# Altium schematic sheet Sheet3_SenseCkts_Programming_Interface.SchDoc
size B; CompanyName: Microchip Technology Inc.; Organization: Microchip Technology; Address1: 2355 West Chandler Blvd.; Address2: Chandler, AZ  85224; Address4: USA; DocumentNumber: 3; SheetNumber: 3; SheetTotal: 5; SheetTitle: Program/Debug Interface + Sensing/Feedback Ckts; Time: Time
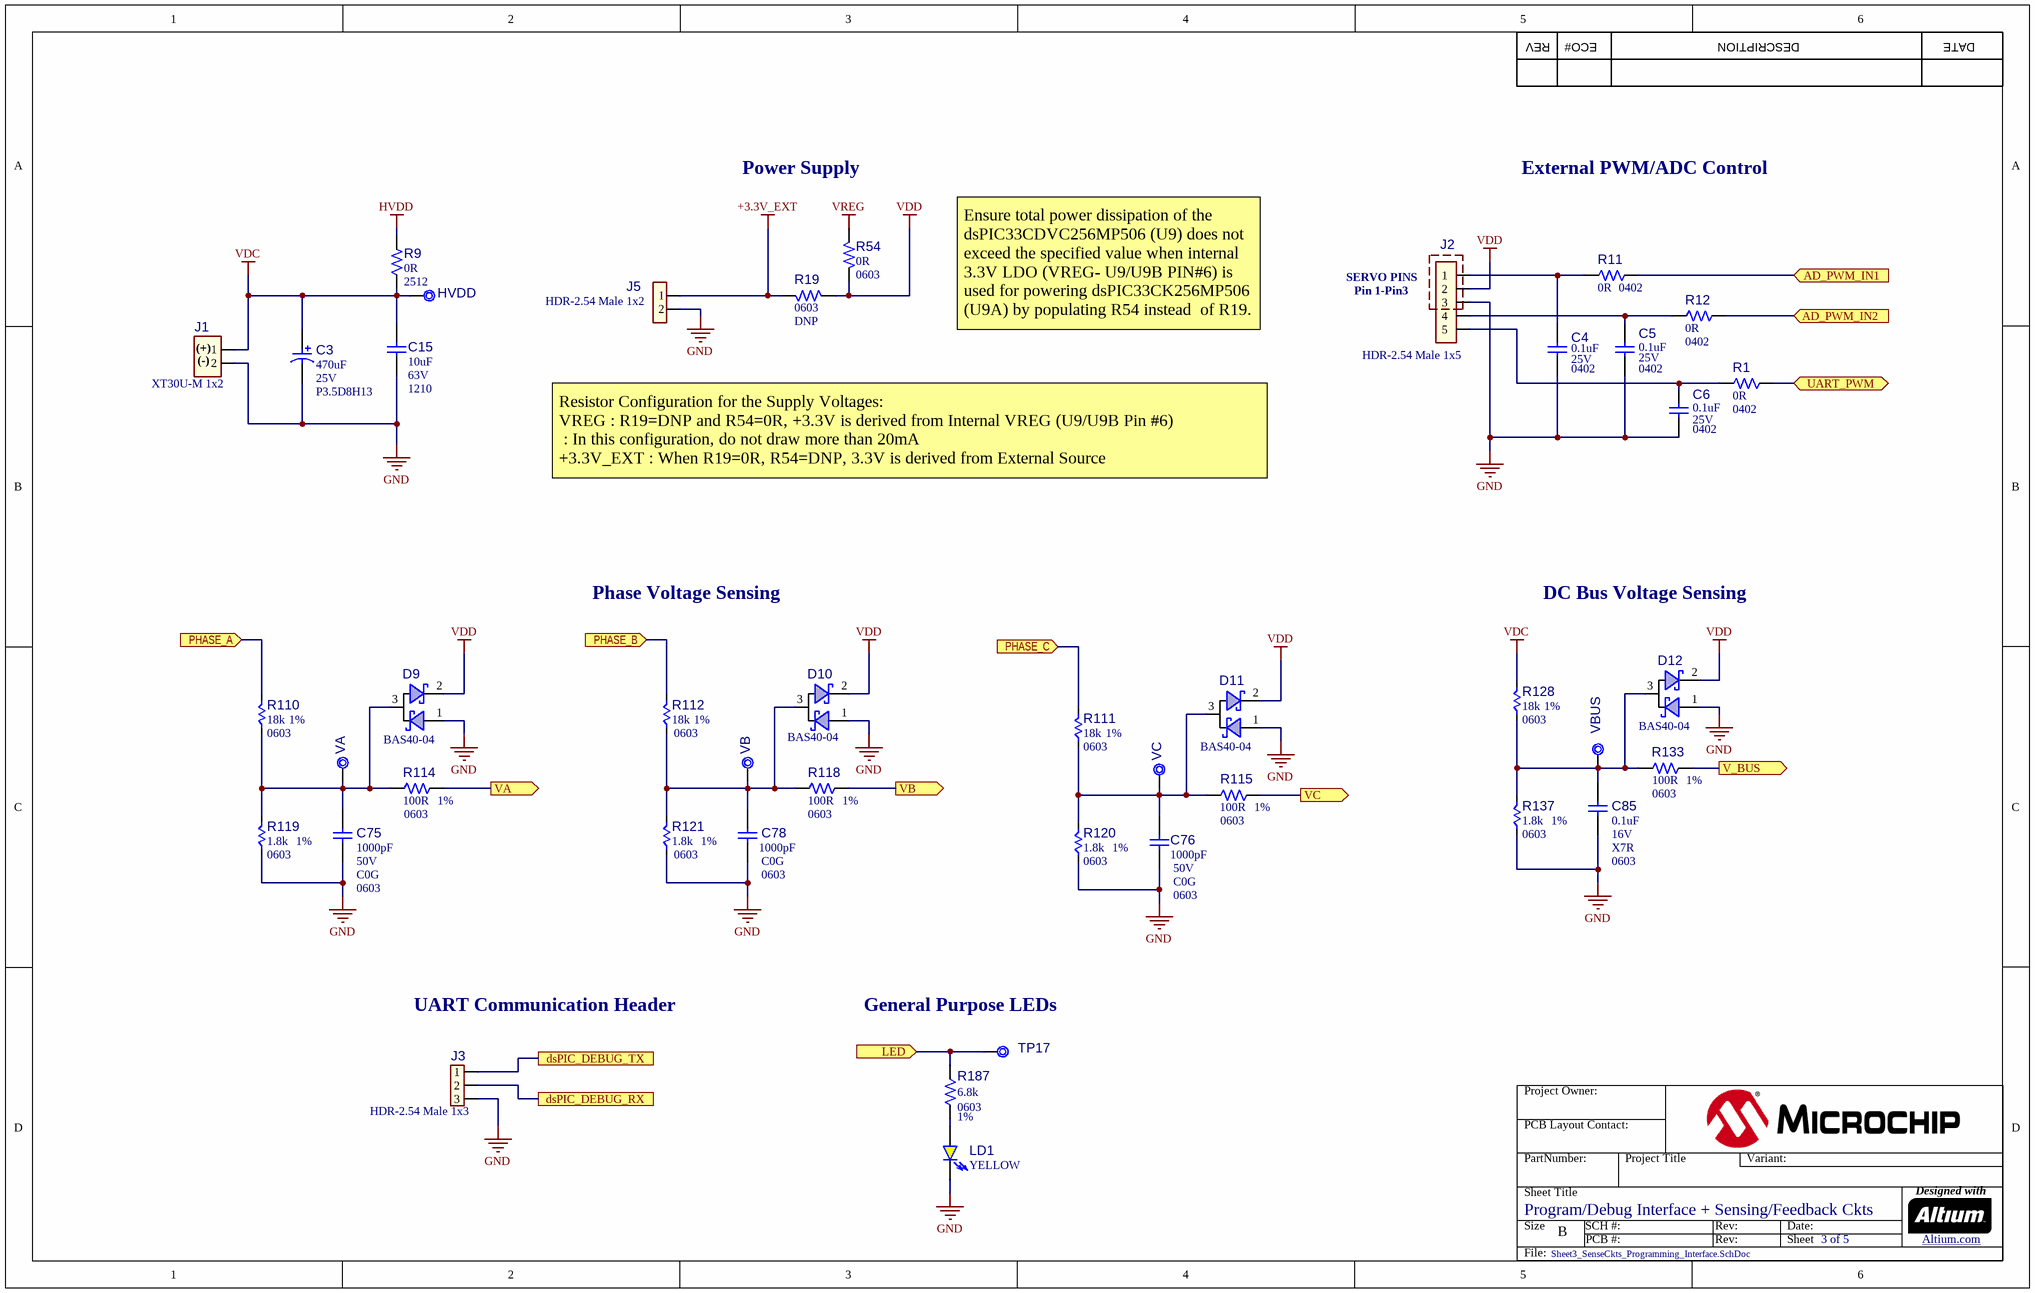
[diagram p0: Sheet3_SenseCkts_Programming_Interface.SchDoc]

## Parts
C3  value 470uF  Voltage: 25V  Package: P3.5D8H13  [CAP_RAD_P3.5D8H13_WE]  (hidden comment: Capacitor POL)
C4  value 0.1uF  Voltage: 25V  Package: 0402  [CAP_C_0402]  (hidden comment: Capacitor NP)
C5  value 0.1uF  Voltage: 25V  Package: 0402  [CAP_C_0402]  (hidden comment: Capacitor NP)
C6  value 0.1uF  Voltage: 25V  Package: 0402  [CAP_C_0402]  (hidden comment: Capacitor NP)
C15  value 10uF  Voltage: 63V  Package: 1210  [CAP_C_1210]  (hidden comment: Capacitor NP)
C75  value 1000pF  Voltage: 50V  Package: 0603  Temperature Coeffcient: C0G  [CAP_C_0603]  (hidden comment: Capacitor NP)
C76  value 1000pF  Voltage: 50V  Package: 0603  Temperature Coeffcient: C0G  [CAP_C_0603]  (hidden comment: Capacitor NP)
C78  value 1000pF  Package: 0603  Temperature Coeffcient: C0G  [CAP_C_0603]  (hidden comment: Capacitor NP)
C85  value 0.1uF  Voltage: 16V  Package: 0603  Temperature Coeffcient: X7R  [CAP_C_0603]  (hidden comment: Capacitor NP)
D9  value BAS40-04  [SOT-23-3]  (hidden comment: Diode Schottky Dual AK)
D10  value BAS40-04  [SOT-23-3]  (hidden comment: Diode Schottky Dual AK)
D11  value BAS40-04  [SOT-23-3]  (hidden comment: Diode Schottky Dual AK)
D12  value BAS40-04  [SOT-23-3]  (hidden comment: Diode Schottky Dual AK)
HVDD  Test Point No BOM  [TP_1.1x0.6]  (value not drawn)  (no BOM)
J1  value XT30U-M 1x2  [CON TERMINAL XT30U-M 5mm 1x2 Male 30A TH V]  (hidden comment: CON 1x2 POLARIZED)
J2  value HDR-2.54 Male 1x5  [HDR_M_2.54_1x5_MH5.84_IH2.54_TH3.2_TH_VERT]  (hidden comment: Header 1x5)
J3  value HDR-2.54 Male 1x3  [HDR_M_2.54_1x3_TH_V_SAM_TSW-103-08-G-S]  (hidden comment: Header 1x3)
J5  value HDR-2.54 Male 1x2  [HDR_M_2.54_1x2_TH_V_SAM_TSW-102-08-G-S]  (hidden comment: Header 1x2)
LD1  value YELLOW  [LED_0603_Yellow]  (hidden comment: LED_yellow)
R1  value 0R  Package: 0402  [RES_C_0402]  (hidden comment: Resistor)
R9  value 0R  Package: 2512  [RES_C_2512]  (hidden comment: Resistor)
R11  value 0R  Package: 0402  [RES_C_0402]  (hidden comment: Resistor)
R12  value 0R  Package: 0402  [RES_C_0402]  (hidden comment: Resistor)
R19  Package: 0603  Populated: DNP  [RES_C_0603]  (hidden comment: Resistor)
R54  value 0R  Package: 0603  [RES_C_0603]
R110  value 18k  Package: 0603  Tolerance: 1%  [RES_C_0603]  (hidden comment: Resistor)
R111  value 18k  Package: 0603  Tolerance: 1%  [RES_C_0603]  (hidden comment: Resistor)
R112  value 18k  Package: 0603  Tolerance: 1%  [RES_C_0603]  (hidden comment: Resistor)
R114  value 100R  Package: 0603  Tolerance: 1%  [RES_C_0603]  (hidden comment: Resistor)
R115  value 100R  Package: 0603  Tolerance: 1%  [RES_C_0603]  (hidden comment: Resistor)
R118  value 100R  Package: 0603  Tolerance: 1%  [RES_C_0603]  (hidden comment: Resistor)
R119  value 1.8k  Package: 0603  Tolerance: 1%  [RES_C_0603]  (hidden comment: Resistor)
R120  value 1.8k  Package: 0603  Tolerance: 1%  [RES_C_0603]  (hidden comment: Resistor)
R121  value 1.8k  Package: 0603  Tolerance: 1%  [RES_C_0603]  (hidden comment: Resistor)
R128  value 18k  Package: 0603  Tolerance: 1%  [RES_C_0603]  (hidden comment: Resistor)
R133  value 100R  Package: 0603  Tolerance: 1%  [RES_C_0603]  (hidden comment: Resistor)
R137  value 1.8k  Package: 0603  Tolerance: 1%  [RES_C_0603]  (hidden comment: Resistor)
R187  value 6.8k  Tolerance: 1%  Package: 0603  [RES_C_0603]  (hidden comment: Resistor)
TP17  Test Point No BOM  [TP_TH_0.7PADX0.4HOLE]  (value not drawn)  (no BOM)
VA  Test Point No BOM  [TP_TH_0.7PADX0.4HOLE]  (value not drawn)  (no BOM)
VB  Test Point No BOM  [TP_TH_0.7PADX0.4HOLE]  (value not drawn)  (no BOM)
VBUS  Test Point No BOM  [TP_TH_0.7PADX0.4HOLE]  (value not drawn)  (no BOM)
VC  Test Point No BOM  [TP_TH_0.7PADX0.4HOLE]  (value not drawn)  (no BOM)

## Ports
AD_PWM_IN1 (in), AD_PWM_IN2 (in), dsPIC_DEBUG_RX, dsPIC_DEBUG_TX, LED (in), PHASE_A (in), PHASE_B (in), PHASE_C (in), UART_PWM (bidir), V_BUS (out), VA (out), VB (out), VC (out)

## Nets
+3.3V_EXT: J5.1 R19.2
GND: C3.2 C4.1 C5.1 C6.1 C15.1 C75.1 C76.1 C78.1 C85.1 D9.1(A) D10.1(A) D11.1(A) D12.1(A) J1.2 J2.3 J3.3 J5.2 LD1.2(K) R119.2 R120.2 R121.2 R137.2
HVDD: R9.2
VDC: C3.1 C15.2 HVDD.1 J1.1 R9.1 R128.1
VDD: D9.2(K) D10.2(K) D11.2(K) D12.2(K) J2.2 R19.1 R54.2
VREG: R54.1
AD_PWM_IN1: R11.2 ; port AD_PWM_IN1
AD_PWM_IN2: R12.2 ; port AD_PWM_IN2
dsPIC_DEBUG_RX: J3.2 ; port dsPIC_DEBUG_RX
dsPIC_DEBUG_TX: J3.1 ; port dsPIC_DEBUG_TX
LED: R187.1 TP17.1 ; port LED
PHASE_A: R110.1 ; port PHASE_A
PHASE_B: R112.1 ; port PHASE_B
PHASE_C: R111.1 ; port PHASE_C
UART_PWM: R1.2 ; port UART_PWM
V_BUS: R133.2 ; port V_BUS
VA: R114.2 ; port VA
VB: R118.2 ; port VB
VC: R115.2 ; port VC
NetC4_2: C4.2 J2.1 R11.1
NetC5_2: C5.2 J2.4 R12.1
NetC6_2: C6.2 J2.5 R1.1
NetC75_2: C75.2 D9.3(KA) R110.2 R114.1 R119.1 VA.1
NetC76_2: C76.2 D11.3(KA) R111.2 R115.1 R120.1 VC.1
NetC78_2: C78.2 D10.3(KA) R112.2 R118.1 R121.1 VB.1
NetC85_2: C85.2 D12.3(KA) R128.2 R133.1 R137.1 VBUS.1
NetLD1_1: LD1.1(A) R187.2

## Notes on the sheet
- REV
- ECO#
- DESCRIPTION
- DATE
- Power Supply
- External PWM/ADC Control
- (near J2) SERVO PINS
- (near J2) Pin 1-Pin3
- Ensure total power dissipation of the dsPIC33CDVC256MP506 (U9) does not exceed the specified value when internal 3.3V LDO (VREG- U9/U9B PIN#6) is used for powering dsPIC33CK256MP506 (U9A) by populating R54 instead  of R19.
- Resistor Configuration for the Supply Voltages:
  VREG	: R19=DNP and R54=0R, +3.3V is derived from Internal VREG (U9/U9B Pin #6)
  : In this configuration, do not draw more than 20mA
  +3.3V_EXT : When R19=0R, R54=DNP, 3.3V is derived from External Source
- Phase Voltage Sensing
- DC Bus Voltage Sensing
- UART Communication Header
- (near TP17) General Purpose LEDs
- Project Owner:
- PCB Layout Contact:
- PartNumber:
- Project Title
- Variant:
- Sheet Title
- Size
- B
- SCH #:
- PCB #:
- Rev:
- Date:
- Sheet
- Designed with
- Altium.com <http://go.altium.com/MicrochipLandingPage_Evaluation.html>
- File:
- (in symbol CON2207) (+); (-)

## Library data of the parts
C3 = CAP3116: Capacitor; Manufacturer 1: Würth Elektronik; Manufacturer Part Number 1: 860020474014; Description_: CAP ALU 470uF 25V 20% RAD P3.5D8H13; Dev Tools Status: Design; Tolerance: 20%; Type: Aluminum; Owner: Severino Balong Jr.; Populated: YES; Restricted Sourcing: No; MCHP-ID: CAP3116; Revision: 1; Symbol: Capacitor POL; Status: MCL Design; ComponentLink1URL: https://chn-vm-apps.microchip.com/mchprepo/parts/Datasheets/860020474014.pdf; ComponentLink1Description: SVN Datasheet; ComponentLink2URL: C:\ALTIUM_WORK\00001_MCHP-CDB\Datasheets\860020474014.pdf; ComponentLink2Description: Local Datasheet; ComponentLink3URL: C:\ALTIUM_WORK\00001_MCHP-CDB\Library\LibraryRefs\Capacitor POL.SchLib; ComponentLink3Description: Open Symbol; ComponentLink4URL: C:\ALTIUM_WORK\00001_MCHP-CDB\Library\Footprints\CAP_RAD_P3.5D8H13_WE.PcbLib; ComponentLink4Description: Open Footprint; ComponentLink5Description: Open Footprint 2; ComponentLink6Description: Open Footprint 3; ComponentLink7Description: Open Footprint 4; Operating Temperature: -40C to +105C; Category: Capacitor; Supplier 1: Digi-Key; Supplier Part Number 1: 732-8831-1-ND; Quantity Override: 1
C4-C6 = CAP1345: Manufacturer 1: TDK Corporation; Manufacturer Part Number 1: C1005X7R1E104K050BB; Description_: CAP CER 0.1uF 25V 10% X7R SMD 0402; Dev Tools Status: Production; Tolerance: 10%; Temperature Coefficient: X7R; Type: Ceramic; Owner: Randolph Sobrepena; Populated: YES; Restricted Sourcing: No; MCHP-ID: CAP1345; Revision: 2; Symbol: Capacitor NP; Status: MCL Design; ComponentLink1URL: https://chn-vm-apps.microchip.com/mchprepo/parts/Datasheets/mlcc_commercial_general_en; ComponentLink1Description: SVN Datasheet; ComponentLink2URL: C:\ALTIUM_WORK\00001_MCHP-CDB\Datasheets\mlcc_commercial_general_en; ComponentLink2Description: Local Datasheet; ComponentLink3URL: C:\ALTIUM_WORK\00001_MCHP-CDB\Library\LibraryRefs\Capacitor NP.SchLib; ComponentLink3Description: Open Symbol; ComponentLink4URL: C:\ALTIUM_WORK\00001_MCHP-CDB\Library\Footprints\CAP_C_0402.PcbLib; ComponentLink4Description: Open Footprint; ComponentLink5Description: Open Footprint 2; ComponentLink6Description: Open Footprint 3; ComponentLink7Description: Open Footprint 4; Operating Temperature: -55°C to 125°C; Category: Capacitor; Supplier 1: Digi-Key; Supplier Part Number 1: 445-7348-1-ND; Quantity Override: 1
C15 = CAP2578: Manufacturer 1: Samsung Electro-Mechanics; Manufacturer Part Number 1: CL32B106KMVNNWE; Description_: CAP CER 10uF 63V 10% X7R SMD 1210; Dev Tools Status: Design; Tolerance: 10%; Temperature Coefficient: X7R; Type: Ceramic; Owner: Narasimha Murthy; Populated: YES; MCHP-ID: CAP2578; Revision: 1; Symbol: Capacitor NP; Status: MCL Design; ComponentLink1URL: https://chn-vm-apps.microchip.com/mchprepo/parts/Datasheets/CL32B106KMVNNWE_Spec.pdf; ComponentLink1Description: SVN Datasheet; ComponentLink2URL: C:\ALTIUM_WORK\00001_MCHP-CDB\Datasheets\CL32B106KMVNNWE_Spec.pdf; ComponentLink2Description: Local Datasheet; ComponentLink3URL: C:\ALTIUM_WORK\00001_MCHP-CDB\Library\LibraryRefs\Capacitor NP.SchLib; ComponentLink3Description: Open Symbol; ComponentLink4URL: C:\ALTIUM_WORK\00001_MCHP-CDB\Library\Footprints\CAP_C_1210.PcbLib; ComponentLink4Description: Open Footprint; ComponentLink5Description: Open Footprint 2; ComponentLink6Description: Open Footprint 3; ComponentLink7Description: Open Footprint 4; Operating Temperature: -55C to +125C; Category: Capacitor; Supplier 1: Digi-Key; Supplier Part Number 1: 1276-7053-1-ND; Quantity Override: 1
C75 C76 = CAP0594: Capacitor; Manufacturer 1: AVX; Manufacturer Part Number 1: 06035A102JAT2A; Description_: CAP CER 1000pF 50V 5% C0G SMD 0603; Dev Tools Status: Production; Tolerance: 5%; Type: Ceramic; Populated: Yes; MCHP-ID: CAP0594; Revision: 1; Symbol: Capacitor NP; Status: MCL Design; ComponentLink1URL: https://chn-vm-apps.microchip.com/mchprepo/parts/Datasheets/smccp.pdf; ComponentLink1Description: SVN Datasheet; ComponentLink2URL: C:\ALTIUM_WORK\00001_MCHP-CDB\Datasheets\smccp.pdf; ComponentLink2Description: Local Datasheet; ComponentLink3URL: C:\ALTIUM_WORK\00001_MCHP-CDB\Library\LibraryRefs\Capacitor NP.SchLib; ComponentLink3Description: Open Symbol; ComponentLink4URL: C:\ALTIUM_WORK\00001_MCHP-CDB\Library\Footprints\CAP_C_0603.PcbLib; ComponentLink4Description: Open Footprint; ComponentLink5Description: Open Footprint 2; ComponentLink6Description: Open Footprint 3; ComponentLink7Description: Open Footprint 4; Operating Temperature: -55C to +125C; Category: Capacitor; Manufacturer 2: TDK; Manufacturer Part Number 2: C1608C0G1H102J; Manufacturer 3: Murata Electronics North America; Manufacturer Part Number 3: GCM1885C1H102JA16D; Supplier 1: Digi-Key; Supplier Part Number 1: 478-1187-2-ND; Supplier 2: Digi-Key; Supplier Part Number 2: 445-1293-2-ND; Supplier 3: Digi-Key; Supplier Part Number 3: 490-4768-1-ND; Quantity Override: 1
C78 = CAP0594: Capacitor; Manufacturer 1: AVX; Manufacturer Part Number 1: 06035A102JAT2A; Voltage: 50V; Description_: CAP CER 1000pF 50V 5% C0G SMD 0603; Dev Tools Status: Production; Tolerance: 5%; Type: Ceramic; Populated: Yes; MCHP-ID: CAP0594; Revision: 1; Symbol: Capacitor NP; Status: MCL Design; ComponentLink1URL: https://chn-vm-apps.microchip.com/mchprepo/parts/Datasheets/smccp.pdf; ComponentLink1Description: SVN Datasheet; ComponentLink2URL: C:\ALTIUM_WORK\00001_MCHP-CDB\Datasheets\smccp.pdf; ComponentLink2Description: Local Datasheet; ComponentLink3URL: C:\ALTIUM_WORK\00001_MCHP-CDB\Library\LibraryRefs\Capacitor NP.SchLib; ComponentLink3Description: Open Symbol; ComponentLink4URL: C:\ALTIUM_WORK\00001_MCHP-CDB\Library\Footprints\CAP_C_0603.PcbLib; ComponentLink4Description: Open Footprint; ComponentLink5Description: Open Footprint 2; ComponentLink6Description: Open Footprint 3; ComponentLink7Description: Open Footprint 4; Operating Temperature: -55C to +125C; Category: Capacitor; Manufacturer 2: TDK; Manufacturer Part Number 2: C1608C0G1H102J; Manufacturer 3: Murata Electronics North America; Manufacturer Part Number 3: GCM1885C1H102JA16D; Supplier 1: Digi-Key; Supplier Part Number 1: 478-1187-2-ND; Supplier 2: Digi-Key; Supplier Part Number 2: 445-1293-2-ND; Supplier 3: Digi-Key; Supplier Part Number 3: 490-4768-1-ND; Quantity Override: 1
C85 = CAP0011: Capacitor; Manufacturer 1: Taiyo Yuden; Manufacturer Part Number 1: EMK107B7104KA-T; Description_: CAP CER 0.1uF 16V 10% X7R SMD 0603; Dev Tools Status: Production; Tolerance: 10%; Type: Ceramic; Owner: Cristian Papuc; Populated: YES; MCHP-ID: CAP0011; Revision: 3; Symbol: Capacitor NP; Status: MCL Design; ComponentLink1URL: https://chn-vm-apps.microchip.com/mchprepo/parts/Datasheets/nmc2.pdf; ComponentLink1Description: SVN Datasheet; ComponentLink2URL: C:\ALTIUM_WORK\00001_MCHP-CDB\Datasheets\nmc2.pdf; ComponentLink2Description: Local Datasheet; ComponentLink3URL: C:\ALTIUM_WORK\00001_MCHP-CDB\Library\LibraryRefs\Capacitor NP.SchLib; ComponentLink3Description: Open Symbol; ComponentLink4URL: C:\ALTIUM_WORK\00001_MCHP-CDB\Library\Footprints\CAP_C_0603.PcbLib; ComponentLink4Description: Open Footprint; ComponentLink5Description: Open Footprint 2; ComponentLink6Description: Open Footprint 3; ComponentLink7Description: Open Footprint 4; Operating Temperature: -55C to +125C; Category: Capacitor; Manufacturer 2: Wurth Electronics Inc; Manufacturer Part Number 2: 885012206046; Manufacturer 3: Samsung; Manufacturer Part Number 3: CL10B104KO8NNNC; Manufacturer 4: AVX; Manufacturer Part Number 4: 0603YC104KAT2A; Manufacturer 5: Murata; Manufacturer Part Number 5: GRM188R71C104KA01D; Manufacturer 6: Yageo; Manufacturer Part Number 6: CC0603KRX7R7BB104; Manufacturer 7: Taiyo Yuden; Manufacturer Part Number 7: EMK107B7104KA-T; Manufacturer 8: Murata Electronics North America; Manufacturer Part Number 8: GCM188R71C104KA37D; Supplier 1: Digi-Key; Supplier Part Number 1: 587-1240-1-ND; Supplier 2: Digi-Key; Supplier Part Number 2: 732-7965-1-ND; Supplier 3: Digi-Key; Supplier Part Number 3: 1276-1005-1-ND; Supplier 4: Digi-Key; Supplier Part Number 4: 478-1239-1-ND; Supplier 5: Digi-Key; Supplier Part Number 5: 490-1532-1-ND; Supplier 6: Digi-Key; Supplier Part Number 6: 311-1088-1-ND; Supplier 7: Newark; Supplier Part Number 7: 86H5248; Supplier 8: Digi-Key; Supplier Part Number 8: 490-4774-1-ND; Quantity Override: 1
D9-D12 = DIODE1074: Manufacturer 1: Vishay Semiconductor Diodes Division; Manufacturer Part Number 1: BAS40-04-E3-08; Description_: DIO SCTKYARR BAS40-04 1V 200mA 40V SOT-23-3; Dev Tools Status: Production; Type: Schottky Array; Forward Current: 200mA; Power: 200mW; Reverse Current: 100nA; Reverse Voltage: 40V; Owner: Stephen Humberd; Populated: YES; MCHP-ID: DIODE1074; Revision: A; Symbol: Diode Schottky DUAL AK; Status: MCL Design; Package: SOT-23-3; ComponentLink1URL: https://chn-vm-apps.microchip.com/mchprepo/parts/Datasheets/bas40v.pdf; ComponentLink1Description: SVN Datasheet; ComponentLink2URL: C:\ALTIUM_WORK\00001_MCHP-CDB\Datasheets\bas40v.pdf; ComponentLink2Description: Local Datasheet; ComponentLink3URL: C:\ALTIUM_WORK\00001_MCHP-CDB\Library\LibraryRefs\Diode Schottky DUAL AK.SchLib; ComponentLink3Description: Open Symbol; ComponentLink4URL: C:\ALTIUM_WORK\00001_MCHP-CDB\Library\Footprints\SOT-23-3.PcbLib; ComponentLink4Description: Open Footprint; ComponentLink5Description: Open Footprint 2; ComponentLink6Description: Open Footprint 3; ComponentLink7Description: Open Footprint 4; Operating Temperature: -65C to +125C; Category: Diode; Supplier 1: Digi-Key; Supplier Part Number 1: BAS40-04-E3-08CT-ND; Quantity Override: 1
HVDD = CON2734: Test Point; Description_: CON TP PAD PCB TH D1.1H0.6; Dev Tools Status: Design; Owner: Severino Balong Jr.; Populated: DNP; Value: TP TH D1.1H0.6; MCHP-ID: CON2734; Revision: 1; Symbol: Test Point No BOM; Status: MCL Design; ComponentLink1Description: SVN Datasheet; ComponentLink2Description: Local Datasheet; ComponentLink3URL: C:\ALTIUM_WORK\00001_MCHP-CDB\Library\LibraryRefs\Test Point No BOM.SchLib; ComponentLink3Description: Open Symbol; ComponentLink4URL: C:\ALTIUM_WORK\00001_MCHP-CDB\Library\Footprints\TP_1.1x0.6.PcbLib; ComponentLink4Description: Open Footprint; ComponentLink5Description: Open Footprint 2; ComponentLink6Description: Open Footprint 3; ComponentLink7Description: Open Footprint 4; Type: Test Point No BOM; Category: Connector; Quantity Override: 1; Restricted Sourcing: No
J1 = CON2207: Manufacturer 1: AMASS; Manufacturer Part Number 1: XT30U-M; Description_: CON POWER XT30U-M 5mm 1x2 Male 15A TH V; Dev Tools Status: Design; Owner: Octavian Stroe; Voltage: 500V; Current: 15A; Populated: Yes; MCHP-ID: CON2207; Revision: 1; Symbol: CON 1x2 POLARIZED; Status: MCL Design; ComponentLink1URL: https://chn-vm-apps.microchip.com/mchprepo/parts/Datasheets/XT30U SPEC.pdf; ComponentLink1Description: SVN Datasheet; ComponentLink2URL: C:\ALTIUM_WORK\00001_MCHP-CDB\Datasheets\XT30U SPEC.pdf; ComponentLink2Description: Local Datasheet; ComponentLink3URL: C:\ALTIUM_WORK\00001_MCHP-CDB\Library\LibraryRefs\CON 1x2 POLARIZED.SchLib; ComponentLink3Description: Open Symbol; ComponentLink4URL: C:\ALTIUM_WORK\00001_MCHP-CDB\Library\Footprints\CON TERMINAL XT30U-M 5mm 1x2 Male 30A TH V.PcbLib; ComponentLink4Description: Open Footprint; ComponentLink5Description: Open Footprint 2; ComponentLink6Description: Open Footprint 3; ComponentLink7Description: Open Footprint 4; Type: Power; Category: Connector; Supplier 1: TME; Supplier Part Number 1: XT30U-M; Quantity Override: 1
J2 = CON3098: Manufacturer 1: Samtec; Manufacturer Part Number 1: TSW-105-26-S-S; Description_: CON HDR-2.54 Male 1x5 Gold 5.84MH 2.54IH 3.2TH TH VERT; Dev Tools Status: Design; Owner: Deepak Kariyappa; Populated: YES; Restricted Sourcing: No; MCHP-ID: CON3098; Revision: 1; Symbol: Header 1x5; Status: MCL Design; ComponentLink1URL: https://chn-vm-apps.microchip.com/mchprepo/parts/Datasheets/tsw_th.pdf; ComponentLink1Description: SVN Datasheet; ComponentLink2URL: C:\ALTIUM_WORK\00001_MCHP-CDB\Datasheets\tsw_th.pdf; ComponentLink2Description: Local Datasheet; ComponentLink3URL: C:\ALTIUM_WORK\00001_MCHP-CDB\Library\LibraryRefs\Header 1x5.SchLib; ComponentLink3Description: Open Symbol; ComponentLink4URL: C:\ALTIUM_WORK\00001_MCHP-CDB\Library\Footprints\HDR_M_2.54_1x5_MH5.84_IH2.54_TH3.2_TH_VERT.PcbLib; ComponentLink4Description: Open Footprint; ComponentLink5Description: Open Footprint 2; ComponentLink6Description: Open Footprint 3; ComponentLink7Description: Open Footprint 4; Type: Header 2.54mm; Category: Connector; Supplier 1: Digi-Key; Supplier Part Number 1: 612-TSW-105-26-S-S-ND; Quantity Override: 1; Assembly Type: TH; Operating Temperature: –55C to +125C
J3 = CON2895: Manufacturer 1: Samtec; Manufacturer Part Number 1: TSW-103-08-G-S; Description_: CON HDR-2.54 Male 1x3 Gold 5.84MH  TH VERT; Dev Tools Status: Production; Owner: Dragos Danaila; Populated: YES; Restricted Sourcing: No; Voltage: 550VAC; Current: 6.3A; MCHP-ID: CON2895; Revision: 3; Symbol: Header 1x3; Status: MCL Design; ComponentLink1URL: https://chn-vm-apps.microchip.com/mchprepo/parts/Datasheets/tsw_th.pdf; ComponentLink1Description: SVN Datasheet; ComponentLink2URL: C:\ALTIUM_WORK\00001_MCHP-CDB\Datasheets\tsw_th.pdf; ComponentLink2Description: Local Datasheet; ComponentLink3URL: C:\ALTIUM_WORK\00001_MCHP-CDB\Library\LibraryRefs\Header 1x3.SchLib; ComponentLink3Description: Open Symbol; ComponentLink4URL: C:\ALTIUM_WORK\00001_MCHP-CDB\Library\Footprints\HDR_M_2.54_1x3_TH_V_SAM_TSW-103-08-G-S.PcbLib; ComponentLink4Description: Open Footprint; ComponentLink5Description: Open Footprint 2; ComponentLink6Description: Open Footprint 3; ComponentLink7Description: Open Footprint 4; Type: Header 2.54mm; Category: Connector; Supplier 1: Digi-Key; Supplier Part Number 1: SAM1038-03-ND; Quantity Override: 1; Assembly Type: TH; Operating Temperature: -55C to +125C
J5 = CON2887: Manufacturer 1: Samtec Inc.; Manufacturer Part Number 1: TSW-102-08-G-S; Description_: CON HDR-2.54 Male 1x2 Gold 5.84MH TH VERT; Dev Tools Status: Design; Owner: Dragos Danaila; Populated: YES; Restricted Sourcing: No; Voltage: 550VAC; Current: 6.3A; MCHP-ID: CON2887; Revision: 1; Symbol: Header 1x2; Status: MCL Design; ComponentLink1URL: https://chn-vm-apps.microchip.com/mchprepo/parts/Datasheets/https://suddendocs.samtec.com/prints/tsw-xxx-xx-x-x-xx-xxx-footprint.pdf; ComponentLink1Description: SVN Datasheet; ComponentLink2URL: C:\ALTIUM_WORK\00001_MCHP-CDB\Datasheets\https://suddendocs.samtec.com/prints/tsw-xxx-xx-x-x-xx-xxx-footprint.pdf; ComponentLink2Description: Local Datasheet; ComponentLink3URL: C:\ALTIUM_WORK\00001_MCHP-CDB\Library\LibraryRefs\Header 1x2.SchLib; ComponentLink3Description: Open Symbol; ComponentLink4URL: C:\ALTIUM_WORK\00001_MCHP-CDB\Library\Footprints\HDR_M_2.54_1x2_TH_V_SAM_TSW-102-08-G-S.PcbLib; ComponentLink4Description: Open Footprint; ComponentLink5Description: Open Footprint 2; ComponentLink6Description: Open Footprint 3; ComponentLink7Description: Open Footprint 4; Type: Header 2.54mm; Category: Connector; Supplier 1: Digi-Key; Supplier Part Number 1: SAM1038-02-ND; Quantity Override: 1; Operating Temperature: -55C to +155C; Assembly Type: TH
LD1 = LED1102: LED; Manufacturer 1: WURTH ELEKTRONIK; Manufacturer Part Number 1: 150060YS75000; Description_: DIO LED YELLOW 2V 20mA 120mcd Clear SMD 0603; Dev Tools Status: Design; Type: LED Single; Forward Current: 20mA; Power: 72mW; Reverse Voltage: 5V; Owner: Narasimha Murthy; Populated: YES; MCHP-ID: LED1102; Revision: 1; Symbol: LED_yellow; Status: MCL Design; ComponentLink1URL: https://chn-vm-apps.microchip.com/mchprepo/parts/Datasheets/150060YS75000.pdf; ComponentLink1Description: SVN Datasheet; ComponentLink2URL: C:\ALTIUM_WORK\00001_MCHP-CDB\Datasheets\150060YS75000.pdf; ComponentLink2Description: Local Datasheet; ComponentLink3URL: C:\ALTIUM_WORK\00001_MCHP-CDB\Library\LibraryRefs\LED_yellow.SchLib; ComponentLink3Description: Open Symbol; ComponentLink4URL: C:\ALTIUM_WORK\00001_MCHP-CDB\Library\Footprints\LED_0603_Yellow.PcbLib; ComponentLink4Description: Open Footprint; ComponentLink5Description: Open Footprint 2; ComponentLink6Description: Open Footprint 3; ComponentLink7Description: Open Footprint 4; Operating Temperature: -40C to +85C; Category: Diode; Supplier 1: Digi-Key; Supplier Part Number 1: 732-4981-1-ND; Quantity Override: 1
R1 R11 R12 = RES2903: Manufacturer 1: Yageo; Manufacturer Part Number 1: RC0402JR-070RP; Description_: RES TKF 0R 1/16W SMD 0402; Dev Tools Status: Production; Populated: YES; Owner: Balaji Narayana; Voltage: 50V; Current: 1A; Power: 1/16W; MCHP-ID: RES2903; Revision: 1; Symbol: Resistor; Status: MCL Design; ComponentLink1URL: https://chn-vm-apps.microchip.com/mchprepo/parts/Datasheets/RC0402JR-070RP.pdf; ComponentLink1Description: SVN Datasheet; ComponentLink2URL: C:\ALTIUM_WORK\00001_MCHP-CDB\Datasheets\RC0402JR-070RP.pdf; ComponentLink2Description: Local Datasheet; ComponentLink3URL: C:\ALTIUM_WORK\00001_MCHP-CDB\Library\LibraryRefs\Resistor.SchLib; ComponentLink3Description: Open Symbol; ComponentLink4URL: C:\ALTIUM_WORK\00001_MCHP-CDB\Library\Footprints\RES_C_0402.PcbLib; ComponentLink4Description: Open Footprint; ComponentLink5Description: Open Footprint 2; ComponentLink6Description: Open Footprint 3; ComponentLink7Description: Open Footprint 4; Operating Temperature: -55C to +155C; Category: Resistor; Type: RES SMD; Supplier 1: Digi-Key; Supplier Part Number 1: YAG1279TR-ND; Quantity Override: 1; Composition: TKF
R9 = RES2467: Manufacturer 1: Vishay Dale; Manufacturer Part Number 1: CRCW25120000Z0EG; Description_: RES TKF 0R JUMPER 1W AEC-Q200 SMD 2512; Dev Tools Status: Design; Voltage: 500V; Power: 1W; Owner: Narasimha Murthy; Populated: YES; MCHP-ID: RES2467; Revision: 1; Symbol: Resistor; Status: MCL Design; ComponentLink1URL: https://chn-vm-apps.microchip.com/mchprepo/parts/Datasheets/dcrcwe3.pdf; ComponentLink1Description: SVN Datasheet; ComponentLink2URL: C:\ALTIUM_WORK\00001_MCHP-CDB\Datasheets\dcrcwe3.pdf; ComponentLink2Description: Local Datasheet; ComponentLink3URL: C:\ALTIUM_WORK\00001_MCHP-CDB\Library\LibraryRefs\Resistor.SchLib; ComponentLink3Description: Open Symbol; ComponentLink4URL: C:\ALTIUM_WORK\00001_MCHP-CDB\Library\Footprints\RES_C_2512.PcbLib; ComponentLink4Description: Open Footprint; ComponentLink5Description: Open Footprint 2; ComponentLink6Description: Open Footprint 3; ComponentLink7Description: Open Footprint 4; Operating Temperature: -55C to +155C; Category: Resistor; Type: RES SMD; Composition: TKF; Supplier 1: Digi-Key; Supplier Part Number 1: 541-0.0XCT-ND; Quantity Override: 1
R19 = RSMT0001: Manufacturer 1: Panasonic; Manufacturer Part Number 1: ERJ-3GEY0R00V; Value: 0R; Description_: RES TKF 0R 1/10W SMD 0603; Dev Tools Status: Production; Power: 1/10W; MCHP-ID: RSMT0001; Revision: 7; Status: MCL Design; ComponentLink1URL: https://chn-vm-apps.microchip.com/mchprepo/parts/Datasheets/nrc.pdf; ComponentLink1Description: SVN Datasheet; Operating Temperature: -55C to +155C; Category: Resistor; Type: RES SMD; Composition: TKF; Manufacturer 2: Stackpole Electronics Inc; Manufacturer Part Number 2: RMCF0603ZT0R00; Manufacturer 3: Vishay; Manufacturer Part Number 3: CRCW06030000Z0EA; Manufacturer 4: Yageo; Manufacturer Part Number 4: RC0603JR-070RL; Manufacturer 5: KOA Speer; Manufacturer Part Number 5: RK73Z1JTTP; Supplier 1: Digi-Key; Supplier Part Number 1: P0.0GTR-ND; Supplier 2: Digi-Key; Supplier Part Number 2: RMCF0603ZT0R00TR-ND; Supplier 3: Digi-Key; Supplier Part Number 3: RMCF0603ZT0R00CT-ND; Supplier 4: Digi-Key; Supplier Part Number 4: 541-0.0GCT-ND; Supplier 5: Digi-Key; Supplier Part Number 5: 311-0.0GRCT-ND; Supplier 6: Mouser; Supplier Part Number 6: 660-RK73Z1JTTP; Quantity Override: 1; Symbol: Resistor; ComponentLink2URL: C:\ALTIUM_WORK\00001_MCHP-CDB\Datasheets\nrc.pdf; ComponentLink2Description: Local Datasheet; ComponentLink3URL: C:\ALTIUM_WORK\00001_MCHP-CDB\Library\LibraryRefs\Resistor.SchLib; ComponentLink3Description: Open Symbol; ComponentLink4URL: C:\ALTIUM_WORK\00001_MCHP-CDB\Library\Footprints\RES_C_0603.PcbLib; ComponentLink4Description: Open Footprint; ComponentLink5Description: Open Footprint 2; ComponentLink6Description: Open Footprint 3; ComponentLink7Description: Open Footprint 4
R54 = RSMT0001: Resistor; Manufacturer 1: Panasonic; Manufacturer Part Number 1: ERJ-3GEY0R00V; Description_: RES TKF 0R 1/10W SMD 0603; Dev Tools Status: Production; Power: 1/10W; Populated: Yes; MCHP-ID: RSMT0001; Revision: 7; Status: MCL Design; ComponentLink1URL: https://chn-vm-apps.microchip.com/mchprepo/parts/Datasheets/nrc.pdf; ComponentLink1Description: SVN Datasheet; Operating Temperature: -55C to +155C; Category: Resistor; Type: RES SMD; Composition: TKF; Manufacturer 2: Stackpole Electronics Inc; Manufacturer Part Number 2: RMCF0603ZT0R00; Manufacturer 3: Vishay; Manufacturer Part Number 3: CRCW06030000Z0EA; Manufacturer 4: Yageo; Manufacturer Part Number 4: RC0603JR-070RL; Manufacturer 5: KOA Speer; Manufacturer Part Number 5: RK73Z1JTTP; Supplier 1: Digi-Key; Supplier Part Number 1: P0.0GTR-ND; Supplier 2: Digi-Key; Supplier Part Number 2: RMCF0603ZT0R00TR-ND; Supplier 3: Digi-Key; Supplier Part Number 3: RMCF0603ZT0R00CT-ND; Supplier 4: Digi-Key; Supplier Part Number 4: 541-0.0GCT-ND; Supplier 5: Digi-Key; Supplier Part Number 5: 311-0.0GRCT-ND; Supplier 6: Mouser; Supplier Part Number 6: 660-RK73Z1JTTP; Quantity Override: 1; Symbol: Resistor; ComponentLink2URL: C:\ALTIUM_WORK\00001_MCHP-CDB\Datasheets\nrc.pdf; ComponentLink2Description: Local Datasheet; ComponentLink3URL: C:\ALTIUM_WORK\00001_MCHP-CDB\Library\LibraryRefs\Resistor.SchLib; ComponentLink3Description: Open Symbol; ComponentLink4URL: C:\ALTIUM_WORK\00001_MCHP-CDB\Library\Footprints\RES_C_0603.PcbLib; ComponentLink4Description: Open Footprint; ComponentLink5Description: Open Footprint 2; ComponentLink6Description: Open Footprint 3; ComponentLink7Description: Open Footprint 4
R110-R112 R128 = RES1126: Manufacturer 1: Panasonic; Manufacturer Part Number 1: ERJ-3EKF1802V; Description_: RES TKF 18k 1% 1/10W SMD 0603; Voltage: 75V; Temperature Coeffcient: 100ppm/C; Power: 1/10W; Owner: Bogdan P (M91398); Populated: Yes; MCHP-ID: RES1126; Revision: 0; Status: Production; ComponentLink1URL: https://chn-vm-apps.microchip.com/mchprepo/parts/Datasheets/AOA0000CE2.pdf; ComponentLink1Description: Datasheet; Operating Temperature: -55C to +155C; Category: Resistor; Type: RES SMD; Composition: TKF; Supplier 1: Digi-Key; Supplier Part Number 1: P18.0KHCT-ND; Quantity Override: 1
R114 R115 R118 R133 = RSMT0324: Manufacturer 1: Panasonic; Manufacturer Part Number 1: ERJ-3EKF1000V; Description_: RES TKF 100R 1% 1/10W SMD 0603; Dev Tools Status: Production; Voltage: 75V; Temperature Coeffcient: 100ppm/C; Power: 1/10W; Populated: Yes; MCHP-ID: RSMT0324; Revision: 2; Symbol: Resistor; Status: MCL Design; ComponentLink1URL: https://chn-vm-apps.microchip.com/mchprepo/parts/Datasheets/AOA0000CE2.pdf; ComponentLink1Description: SVN Datasheet; ComponentLink2URL: C:\ALTIUM_WORK\00001_MCHP-CDB\Datasheets\AOA0000CE2.pdf; ComponentLink2Description: Local Datasheet; ComponentLink3URL: C:\ALTIUM_WORK\00001_MCHP-CDB\Library\LibraryRefs\Resistor.SchLib; ComponentLink3Description: Open Symbol; ComponentLink4URL: C:\ALTIUM_WORK\00001_MCHP-CDB\Library\Footprints\RES_C_0603.PcbLib; ComponentLink4Description: Open Footprint; ComponentLink5Description: Open Footprint 2; ComponentLink6Description: Open Footprint 3; ComponentLink7Description: Open Footprint 4; Operating Temperature: -55C to +155C; Category: Resistor; Type: RES SMD; Composition: TKF; Manufacturer 2: Stackpole Electronics Inc; Manufacturer Part Number 2: RMCF 1/16 100 1% R; Manufacturer 3: Yageo; Manufacturer Part Number 3: RC0603FR-07100RL; Supplier 1: Digi-Key; Supplier Part Number 1: P100HCT-ND; Supplier 2: Digi-Key; Supplier Part Number 2: RMCF1/16100FRTR-ND; Supplier 3: Digi-Key; Supplier Part Number 3: 311-100HRCT-ND; Quantity Override: 1
R119-R121 R137 = RES1110: Manufacturer 1: Panasonic; Manufacturer Part Number 1: ERJ-3EKF1801V; Description_: RES TKF 1.8k 1% 1/10W SMD 0603; Voltage: 75V; Temperature Coeffcient: 100ppm/C; Power: 1/10W; Owner: Bogdan P (M91398); Populated: Yes; MCHP-ID: RES1110; Revision: 0; Status: Production; ComponentLink1URL: https://chn-vm-apps.microchip.com/mchprepo/parts/Datasheets/AOA0000CE2.pdf; ComponentLink1Description: Datasheet; Operating Temperature: -55C to +155C; Category: Resistor; Type: RES SMD; Composition: TKF; Supplier 1: Digi-Key; Supplier Part Number 1: P1.80KHCT-ND; Quantity Override: 1
R187 = RSMT0588: Manufacturer Part Number 1: ERJ-3EKF6801V; Manufacturer 1: Panasonic; Populated: Yes; Power: 1/10W; Voltage: 75V; Description_: RES TKF 6.8k 1% 1/10W SMD 0603; Dev Tools Status: Production; Temperature Coefficient: 100ppm/C; Type: RES SMD; MCHP-ID: RSMT0588; Supplier 1: Digi-Key; Supplier Part Number 1: P6.80KHCT-ND; ComponentLink1Description: SVN Datasheet; Status: MCL Design; Quantity Override: 1; Revision: 1; ComponentLink1URL: https://chn-vm-apps.microchip.com/mchprepo/parts/Datasheets/AOA0000CE2.pdf; Operating Temperature: -55C to +155C; Category: Resistor; Composition: TKF; Symbol: Resistor; ComponentLink2URL: C:\ALTIUM_WORK\00001_MCHP-CDB\Datasheets\AOA0000CE2.pdf; ComponentLink2Description: Local Datasheet; ComponentLink3URL: C:\ALTIUM_WORK\00001_MCHP-CDB\Library\LibraryRefs\Resistor.SchLib; ComponentLink3Description: Open Symbol; ComponentLink4URL: C:\ALTIUM_WORK\00001_MCHP-CDB\Library\Footprints\RES_C_0603.PcbLib; ComponentLink4Description: Open Footprint; ComponentLink5Description: Open Footprint 2; ComponentLink6Description: Open Footprint 3; ComponentLink7Description: Open Footprint 4
TP17 VA VB VBUS VC = CON2938: Test Point; Description_: CON TP PAD PCB TH D0.7H0.4; Owner: Severino Balong Jr.; Populated: DNP; Dev Tools Status: Design; MCHP-ID: CON2938; Revision: 1; Status: MCL Design; ComponentLink1Description: SVN Datasheet; Type: Test Point No BOM; Category: Connector; Quantity Override: 1; Symbol: Test Point No BOM; ComponentLink2Description: Local Datasheet; ComponentLink3URL: C:\ALTIUM_WORK\00001_MCHP-CDB\Library\LibraryRefs\Test Point No BOM.SchLib; ComponentLink3Description: Open Symbol; ComponentLink4URL: C:\ALTIUM_WORK\00001_MCHP-CDB\Library\Footprints\TP_TH_0.7PADX0.4HOLE.PcbLib; ComponentLink4Description: Open Footprint; ComponentLink5Description: Open Footprint 2; ComponentLink6Description: Open Footprint 3; ComponentLink7Description: Open Footprint 4; Assembly Type: TH; Restricted Sourcing: No